# Altium schematic sheet Accelerometer.SchDoc
size B; SheetNumber: 6; SheetTotal: 8
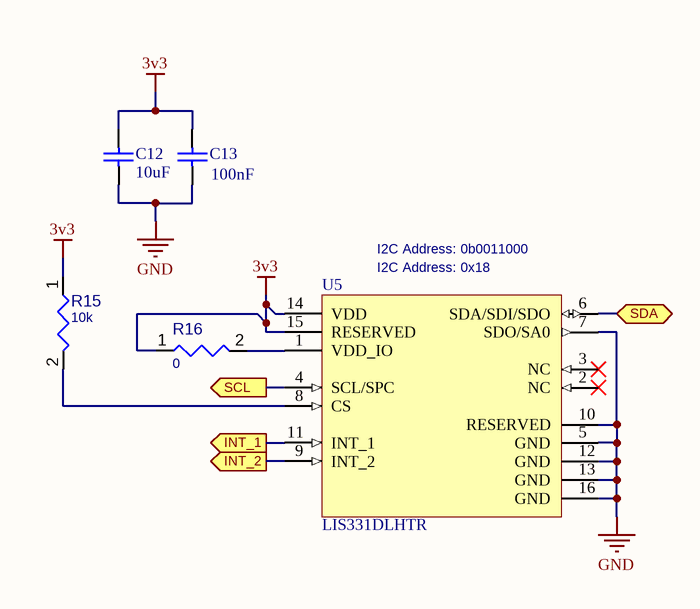
[diagram p0: Accelerometer.SchDoc]

## Parts
C12  Capacitance: 10uF  [Capacitor_0402]  (hidden comment: GRM155R60J106ME44D)
C13  Capacitance: 100nF  [Capacitor_0402]  (hidden comment: GRM155R71E104KE14D)
R15  value 10k  [RESC0402(1005)_L]  (hidden comment: Resistor 10K  +/-1 % 0402 63 mW)
R16  value 0  [RESC0402(1005)_L]  (hidden comment: Jumper 0402)
U5  LIS331DLHTR  [STM-LGA16-3X3X1]

## Ports
INT_1 (out), INT_2 (out), SCL (out), SDA (bidir)

## Nets
3v3: C12.2 C13.2 R15.1 R16.1 U5.14(VDD) U5.15(RESERVED)
GND: C12.1 C13.1 U5.5(GND) U5.7(SDO/SA0) U5.10(RESERVED) U5.12(GND) U5.13(GND) U5.16(GND)
INT_1: U5.11(INT_1) ; port INT_1
INT_2: U5.9(INT_2) ; port INT_2
SCL: U5.4(SCL/SPC) ; port SCL
SDA: U5.6(SDA/SDI/SDO) ; port SDA
NetR15_2: R15.2 U5.8(CS)
NetR16_2: R16.2 U5.1(VDD_IO)

Not connected (* = marked no-connect by the designer): U5 2(NC)* 3(NC)*

## Notes on the sheet
- (near U5) I2C Address: 0b0011000
- (near U5) I2C Address: 0x18

## Library data of the parts
C12 = CMP-00003-1: CAP CER 10UF 6.3V X5R 0402; Tolerance: 20%; Lead Free: Lead Free; Height: 0.5mm; Depth: 0.5mm; Voltage Rating (DC): 6.3V; Case Code (Imperial): 0402; Termination: SMD/SMT; Series: GRM; Case Code (Metric): 1005; Min Operating Temperature: -55°C; Max Operating Temperature: 85°C; RoHS Compliant: Yes; Width: 0.02inch; Voltage Rating: 6.3V; Length: 1mm; Package Quantity: 10000; Thickness: 0.022inch; Packaging: Tape and Reel; Mount: Surface Mount; Dielectric: X5R; REACH SVHC: No SVHC
C13 = CMP-001-00084-3: Chip Capacitor 100nF 0402 25V X7R
R15 = CMP-009-00149-2: Chip Resistor, 10 kOhms, +/-1 %, 63 mW, -55 to 125 degC, 0402; Power: 63mW; Tolerance: 1%; Pins: 2; Max Operating Temperature: 155°C; Min Operating Temperature: -55°C; Case/Package: 0402
R16 = CMP-009-00148-2: Max Operating Temperature: 155°C; Pins: 2; Case/Package: 0402; Min Operating Temperature: -55°C
U5 = CMP-010-00030-1: LIS331DLH Series 3 Axis ±2/±4/±8 g 3.6V Digital Output Nano Accelerometer LGA-16